# EasyEDA Pro project 电赛7_25.epro, board 1-PCB_1-PCB_主板4.3.PcbDoc copy copy
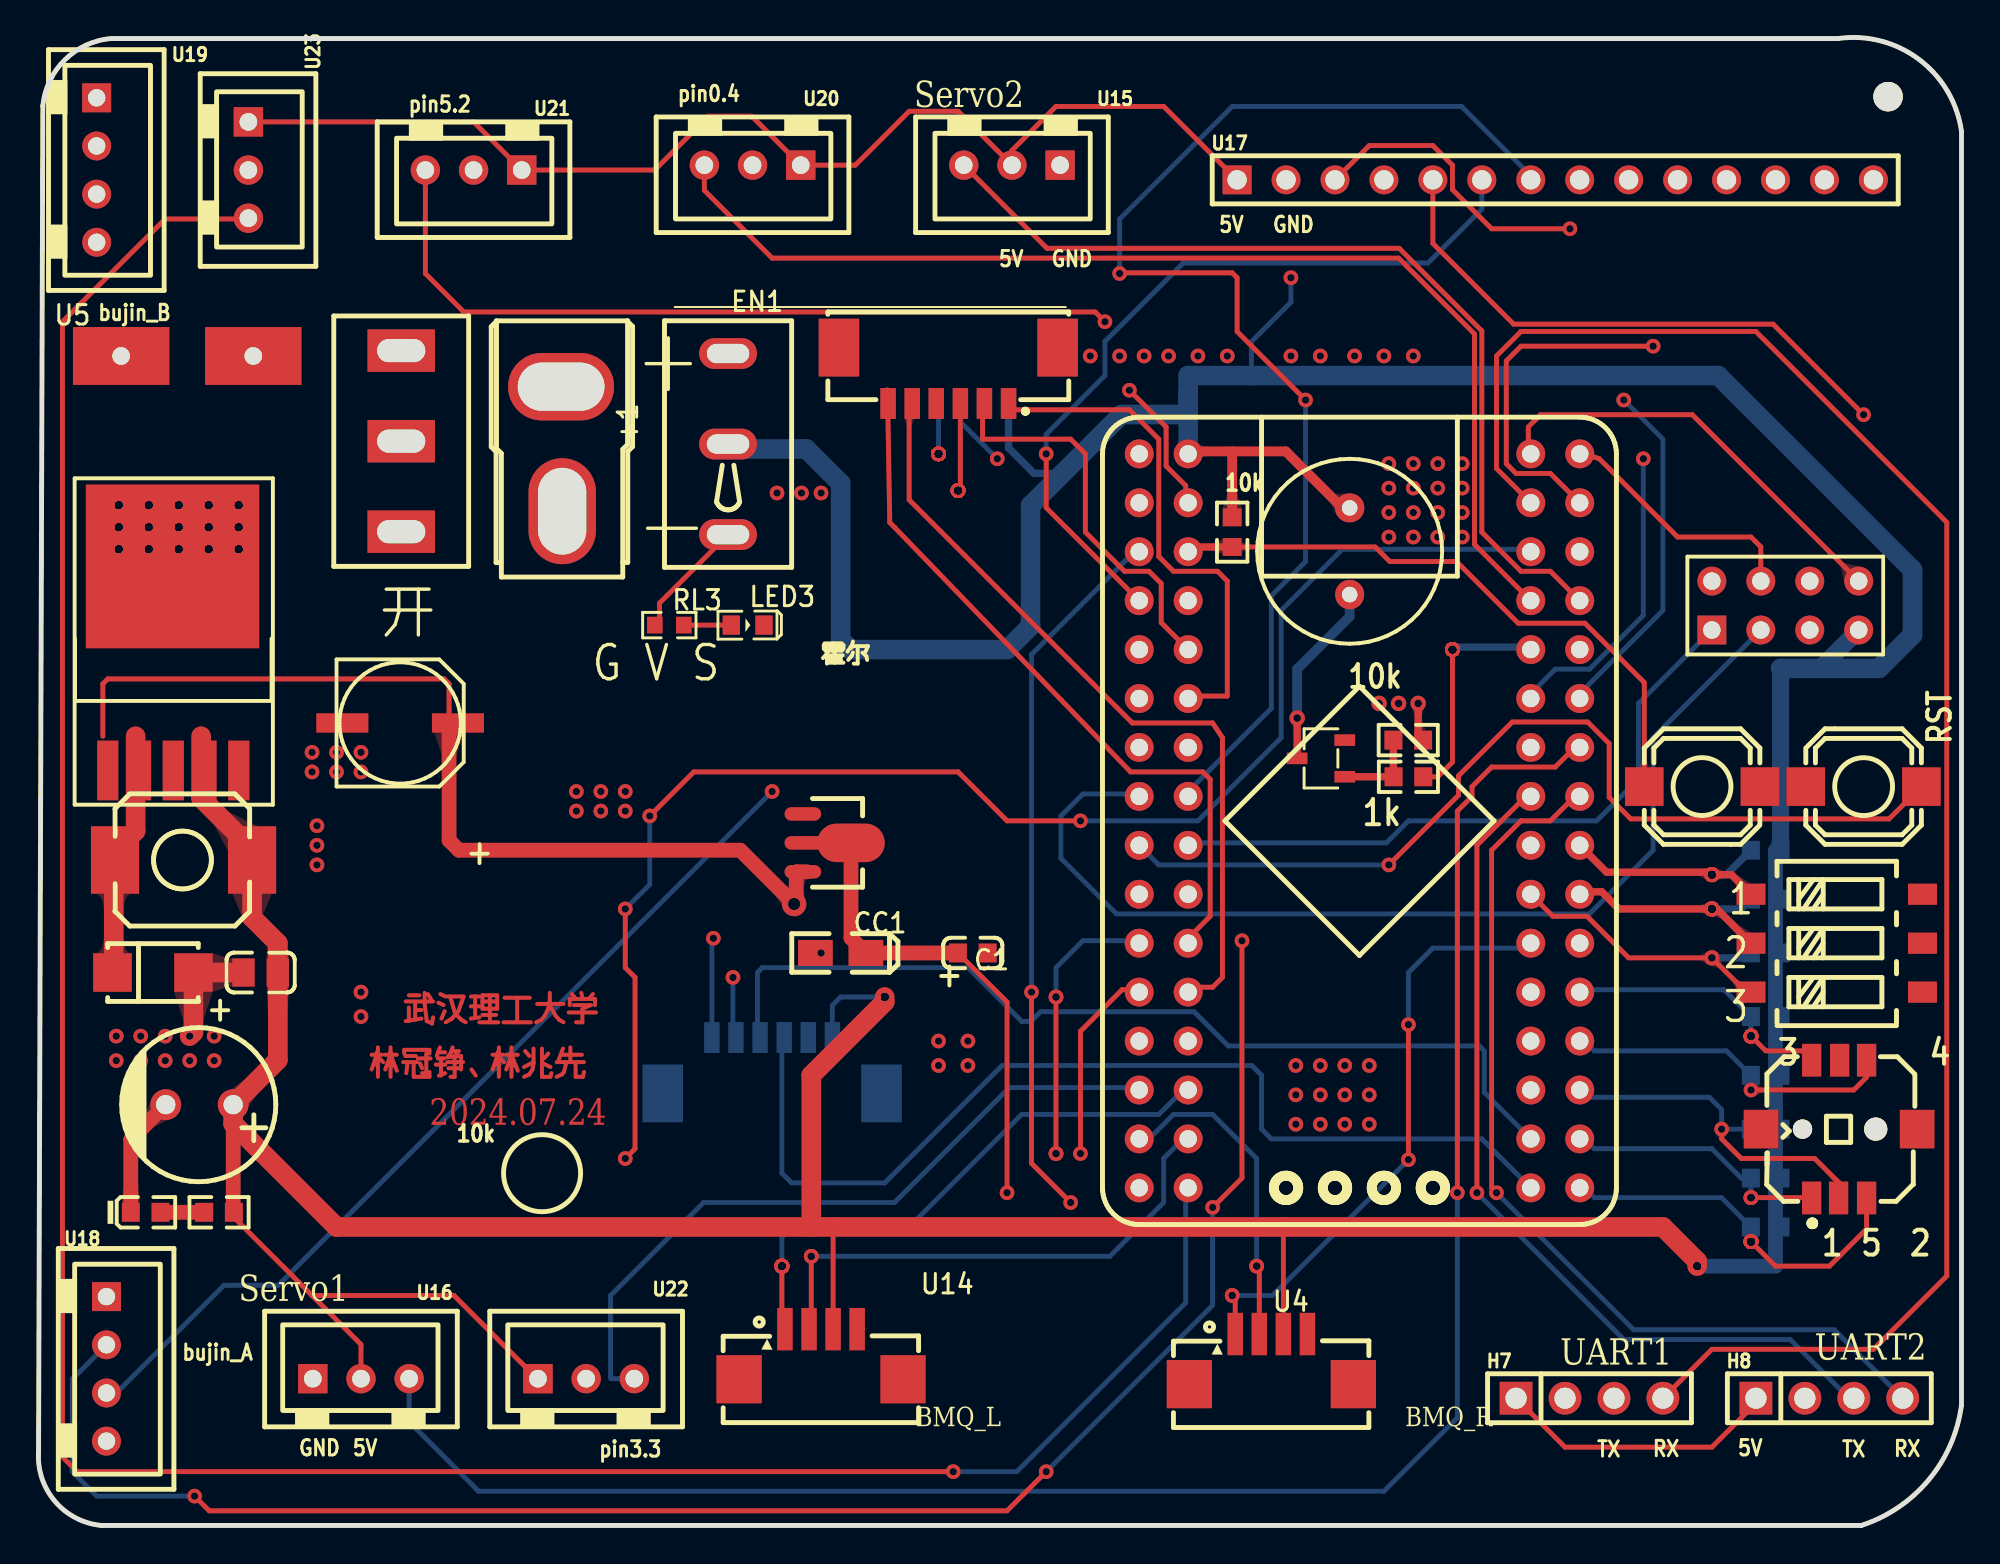
[diagram p1: board, top side]
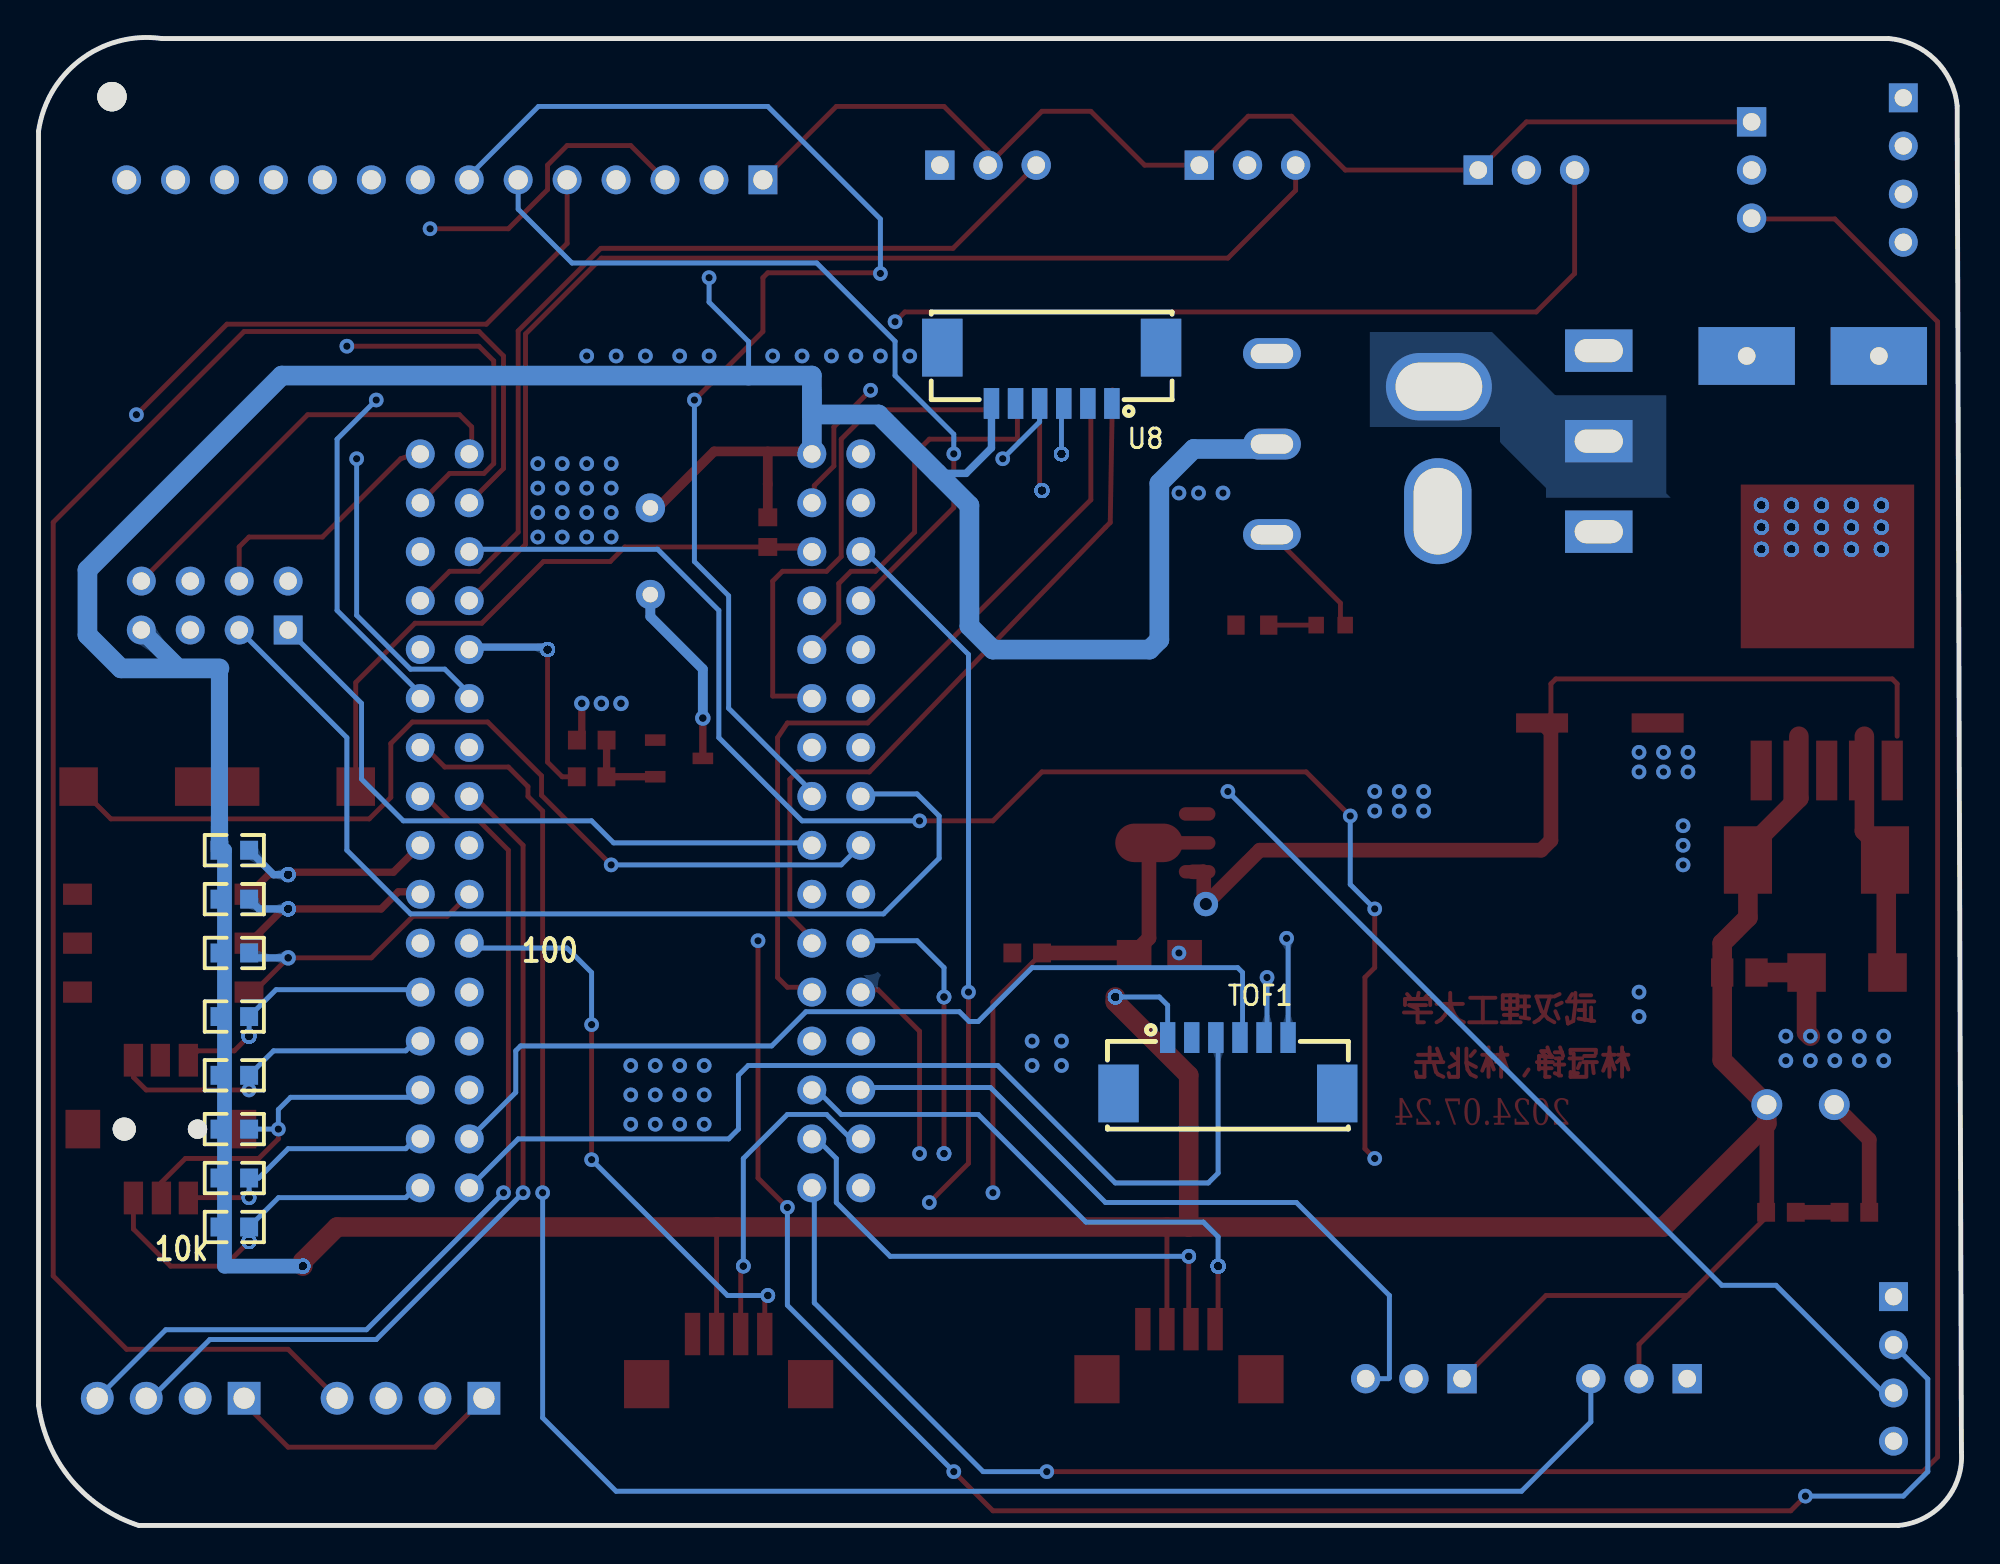
[diagram p2: board, bottom side, seen from below]

Outline 99.8 x 77.24 mm; copper layers: Top Layer, Inner1, Inner2, Bottom Layer. Coordinates in mm from the lower left corner of the outline.
Outline path: 0.01,3.81 0.23,73.69 arc(1.37,76.08) 3.79,77.18 93.4,77.18 arc(97.59,76.1) 99.8,72.37 99.8,6.24 arc(98.1,2.37) 94.6,0 3.28,0 arc(0.87,1.24) 0.01,3.81
Stack: Top Layer 0.035mm / Dielectric1 0.48mm PP er 4.5 / Inner1 0.035mm / Dielectric2 0.48mm FR4 er 4.5 / Inner2 0.035mm / Dielectric3 0.48mm PP er 4.5 / Bottom Layer 0.035mm

## Design rules (mm)
template: 用户自定义配置
spacing Default (default): track to track 0.127, other pairs 0 to 0.127
track width Default (default): min 0.254, default 0.254, max 25.4
differential pair differentialPair (default): width min 0.127, default 0.254, max 2.54; gap min 0.152, default 0.152
via Default (default): diameter min 0.762, default 0.762, max 100.025; hole min 0.381, default 0.381, max 59.995
net GND uses gge31103
net BAT uses gge75352
pour e223 uses gge75889
pour ie748 uses (1)
pour ie751 uses ba't
pour e753 uses gge75352

## Placement (name value [footprint] x y rotation side)
1  1K  [0603_R]  71.1 38.86 180 top
10  10K  [0603_R]  71.09 40.77 180 top
+1  AM-1015B-M  [CONN-TH_AM-1015B-M]  27.15 55.88 270 top
C1  104  [0603_C]  48.49 29.72 180 top
C2  220  [ED6.3]  18.77 41.66 180 top
C3  104  [0805_C]  11.53 28.7 180 top
CC1  22UF  [CASE-A_3216]  41.63 29.72 0 top
CC2  330uF  [CAP-TH_BD8.0-P3.50-D0.6-FD]  8.36 21.84 180 top
D3  SS54  [SMA(DO-214AC)_S1]  5.94 28.7 0 top
EN1  1AS1T1B1M1QES-5  [SW-TH_1AS1T1B1M1QES-5]  35.79 56.13 0 top
H7  2.54-1*4P母  [HDR-TH_4P-P2.54-V-F]  80.49 6.6 0 top
H8  2.54-1*4P母  [HDR-TH_4P-P2.54-V-F]  92.94 6.6 0 top
L2  绿灯 0603  [0603_LED_S1]  5.56 16.26 0 top
L-2  47uH  [7MMUH]  3.98 34.54 0 top
LED3  LED-0603_R  [LED0603_RED]  36.81 46.74 0 top
LS1  BUZZ  [BEEP]  68.05 52.58 270 top
NOREF  -  [Pad_e61]  95.99 74.17 0 top
Q1  S8050(丝印J3Y)  [S8050]  65.32 39.82 0 top
R4  10k  [0603_R]  9.37 16.26 180 top
R5  10K  [0603_R]  89.64 23.37 0 bottom
R6  10K  [0603_R]  89.64 26.42 0 bottom
R7  10K  [0603_R]  89.64 15.49 0 bottom
R8  10K  [0603_R]  89.64 18.03 0 bottom
R9  10K  [0603_R]  89.64 29.72 0 bottom
R10  10K  [0603_R]  89.64 32.51 0 bottom
R11  10K  [0603_R]  89.64 35.05 0 bottom
R17  10K  [0603_R]  89.64 20.57 0 bottom
R18  10K  [0603_R]  61.95 51.56 90 top
RL3  1k  [R0603]  32.74 46.74 0 top
S1  SS-12D10  [SS12D10]  18.77 56.39 90 top
SW3  TS665WS 200GF(016)  [SW-SMD_L6.0-W6.0-P6.00-LS6.6]  86.34 38.35 180 top
SW4  TS665WS 200GF(016)  [SW-SMD_L6.0-W6.0-P6.00-LS6.6]  94.72 38.35 0 top
SW5  DMR-03-T-V-T/R  [DMR-03]  88.88 32.77 270 top
SW_5WAY  TM-4175-B-A  [SW-SMD_TM-4175-B-X]  93.45 20.57 90 top
TOF1  TOF  [CONN-SMD_6P-P1.25_SHOU_1.25-6PWTDK#2]  38.08 23.88 180 bottom
U1  REG1117  [1117_SOT89]  42.17 35.43 180 top
U2  LM2596-5.0v  [LM2596S]  6.83 45.97 0 top
U3  -  [STC16]  68.56 36.58 0 top
U4  encoder2  [CONN-SMD_4P-P1.25_SHOUHAN_1.25-4PWTDK]  63.98 8.64 0 top
U5  大焊盘  [NEW_FOOTPRINT3]  7.6 60.71 90 top
U6  驱动1  [CONN-SMD_6P-P1.25_SHOU_1.25-6PWTDK]  47.22 59.69 0 top
U8  IMU660RA  [CONN-SMD_6P-P1.25_SHOU_1.25-6PWTDK#2]  47.22 59.69 0 bottom
U14  encoder1  [CONN-SMD_4P-P1.25_SHOUHAN_1.25-4PWTDK]  40.62 8.89 0 top
U15  BX-XH2.54-3PZZ  [CONN-TH_3P-P2.50_BX-XH2.54-3PZZ]  50.52 70.61 180 top
U16  BX-XH2.54-3PZZ  [CONN-TH_3P-P2.50_BX-XH2.54-3PZZ]  16.74 7.62 0 top
U17  BX-PM2.54-1-14PY  [HDR-TH_14P-P2.54-V-F-2]  78.72 69.85 0 top
U18  BX-XH2.54-4PZZ  [CONN-TH_4P-P2.50_BX-XH2.54-4PZZ]  3.53 8.13 270 top
U19  BX-XH2.54-4PZZ  [CONN-TH_4P-P2.50_BX-XH2.54-4PZZ]  3.02 70.36 270 top
U20  BX-XH2.54-3PZZ  [CONN-TH_3P-P2.50_BX-XH2.54-3PZZ]  37.06 70.61 180 top
U21  BX-XH2.54-3PZZ  [CONN-TH_3P-P2.50_BX-XH2.54-3PZZ]  22.58 70.36 180 top
U22  BX-XH2.54-3PZZ  [CONN-TH_3P-P2.50_BX-XH2.54-3PZZ]  28.42 7.62 0 top
U23  BX-XH2.54-3PZZ  [CONN-TH_3P-P2.50_BX-XH2.54-3PZZ]  10.9 70.36 270 top
无线串口  Header 4X2  [HDR2X4]  86.84 46.48 0 top

## Footprints (pads in the part's own frame, mm; a bottom-side part is the same pattern mirrored in y, then rotated)
7MMUH
  rect 2.5x3.5 smd: 1(0,0) 2(7.112,0)
0603_C
  rect 0.93x0.98 smd: 1(-0.77,0) 2(0.77,0)
0603_LED_S1
  rect 0.93x0.98 smd: A(0.77,0) K(-0.77,0)
0603_R
  rect 0.93x0.98 smd: 1(-0.77,0) 2(0.77,0)
0805_C
  rect 1.16x1.47 smd: 1(-0.89,0) 2(0.89,0)
1117_SOT89
  oval 1.9x0.7 smd: 1(2.499,-1.501) 3(2.499,1.501)
  oval 2.1x0.7 smd: 2(2.401,0)
  oval 3.5x2 smd: 4(0,0)
BEEP
  oval 1.5x1.524 hole 0.8x0.805: 1(-0.243,0)
  oval 1.524x1.5 hole 0.805x0.8: 2(4.256,0)
CAP-TH_BD8.0-P3.50-D0.6-FD
  round 1.6 hole 1: 1(-1.75,0) 2(1.75,0)
CASE-A_3216
  rect 1.8x1.35 smd: 1(1.31,0) 2(-1.31,0)
CONN-SMD_4P-P1.25_SHOUHAN_1.25-4PWTDK
  rect 0.8x2.2 smd: 1(-1.875,1.3) 2(-0.625,1.3) 3(0.625,1.3) 4(1.875,1.3)
  rect 2.35x2.5 smd: 5(4.255,-1.3) 6(-4.255,-1.3)
CONN-SMD_6P-P1.25_SHOU_1.25-6PWTDK
  rect 0.8x1.6 smd: 1(3.125,-1.45) 2(1.875,-1.45) 3(0.625,-1.45) 4(-0.625,-1.45) 5(-1.875,-1.45) 6(-3.125,-1.45)
  rect 2.1x3 smd: 7(-5.675,1.45) 8(5.675,1.45)
CONN-SMD_6P-P1.25_SHOU_1.25-6PWTDK#2
  rect 0.8x1.6 smd: 1(-3.125,1.45) 2(-1.875,1.45) 3(-0.625,1.45) 4(0.625,1.45) 5(1.875,1.45) 6(3.125,1.45)
  rect 2.1x3 smd: 7(5.675,-1.45) 8(-5.675,-1.45)
CONN-TH_3P-P2.50_BX-XH2.54-3PZZ
  rect 1.524x1.524 hole 0.914: 1(-2.5,0)
  round 1.524 hole 0.914: 2(0,0) 3(2.5,0)
CONN-TH_4P-P2.50_BX-XH2.54-4PZZ
  rect 1.5x1.5 hole 0.9: 1(-3.75,0)
  round 1.5 hole 0.9: 2(-1.25,0) 3(1.25,0) 4(3.75,0)
CONN-TH_AM-1015B-M
  oval 3.5x5.5 hole 2.5x4.5: 1(-3.231,-0.029)
  oval 5.5x3.5 hole 4.5x2.5: 2(3.231,0.029)
DMR-03
  rect 1.1x1.5 smd: 1(5.08,8.9) 2(2.54,8.9) 3(0,8.9) 4(0,0) 5(2.54,0) 6(5.08,0)
ED6.3
  rect 2.7x1 smd: 1(-3,0) 2(3,0)
HDR2X4
  rect 1.5x1.5 hole 0.905x0.9: 1(0,0)
  round 1.5 hole 0.905x0.9: 2(0,2.54) 3(2.54,0) 4(2.54,2.54) 5(5.08,0) 6(5.08,2.54) 7(7.62,0) 8(7.62,2.54)
HDR-TH_4P-P2.54-V-F
  rect 1.7x1.7 hole 1.1: 1(-3.81,0)
  round 1.7 hole 1.1: 2(-1.27,0) 3(1.27,0) 4(3.81,0)
HDR-TH_14P-P2.54-V-F-2
  rect 1.5x1.5 hole 1: 1(-16.51,0)
  round 1.5 hole 1: 2(-13.97,0) 3(-11.43,0) 4(-8.89,0) 5(-6.35,0) 6(-3.81,0) 7(-1.27,0) 8(1.27,0) 9(3.81,0) 10(6.35,0) 11(8.89,0) 12(11.43,0) 13(13.97,0) 14(16.51,0)
LED0603_RED
  rect 0.9x1 smd: 1(-0.85,0) 2(0.85,0)
LM2596S
  rect 1.1x3.1 smd: 1(-3.235,-6.785) 2(-1.535,-6.785) 3(0.165,-6.785) 4(1.865,-6.785) 5(3.565,-6.785)
  rect 9x8.5 smd: 6(0.127,3.81)
NEW_FOOTPRINT3
  rect 3x5 hole 0.914: 1(0,3.302) 2(0,-3.556)
Pad_e61
  round 1.524 hole 3: 65(0,0)
R0603
  rect 0.806x0.864 smd: 1(-0.753,0) 2(0.753,0)
S8050
  rect 1.07x0.6 smd: 1(2.47,-0.95) 2(2.47,0.95) 3(0,0)
SMA(DO-214AC)_S1
  rect 2x2 smd: 1(2.1,0) 2(-2.1,0)
SS12D10
  rect 2.2x3.5 hole 1.2x2.5: 1(-4.803,-0.056) 2(-0.104,-0.056) 3(4.595,-0.056)
STC16
  round 1.5 hole 0.905x0.9: 1(-11.43,19.05) 2(-8.89,19.05) 3(-11.43,16.51) 4(-8.89,16.51) 5(-11.43,13.97) 6(-8.89,13.97) 7(-11.43,11.43) 9(-11.43,8.89) 10(-8.89,8.89) 11(-11.43,6.35) 12(-8.89,6.35) 13(-11.43,3.81) 14(-8.89,3.81) 15(-11.43,1.27) 16(-8.89,1.27) 17(-11.43,-1.27) 18(-8.89,-1.27) 19(-11.43,-3.81) 20(-8.89,-3.81) 21(-11.43,-6.35) 22(-8.89,-6.35) 23(-11.43,-8.89) 24(-8.89,-8.89) 27(-11.43,-13.97) 28(-8.89,-13.97) 29(-11.43,-16.51) 30(-8.89,-16.51) 33(8.89,-19.05) 34(11.43,-19.05) 35(8.89,-16.51) 36(11.43,-16.51) 37(8.89,-13.97) 38(11.43,-13.97) 40(11.43,-11.43) 41(8.89,-8.89) 42(11.43,-8.89) 43(8.89,-6.35) 44(11.43,-6.35) 45(8.89,-3.81) 46(11.43,-3.81) 48(11.43,-1.27) 49(8.89,1.27) 50(11.43,1.27) 51(8.89,3.81) 52(11.43,3.81) 53(8.89,6.35) 55(8.89,8.89) 56(11.43,8.89) 58(11.43,11.43) 59(8.89,13.97) 60(11.43,13.97) 61(8.89,16.51) 63(8.89,19.05) 64(11.43,19.05)
  round 1.5 hole 0.9: 8(-8.89,11.43) 25(-11.43,-11.43) 26(-8.89,-11.43) 31(-11.43,-19.05) 32(-8.89,-19.05) 39(8.89,-11.43) 47(8.89,-1.27) 54(11.43,6.35) 57(8.89,11.43) 62(11.43,16.51)
SW-SMD_L6.0-W6.0-P6.00-LS6.6
  rect 2x2 smd: 1(-3,0) 2(3,0)
SW-SMD_TM-4175-B-X
  rect 1.7x1 smd: 1(-3.575,1.425) 2(-3.575,0.028) 3(-3.575,-1.425) 4(3.575,1.425) 5(3.575,-0.028) 6(3.575,-1.425)
  rect 2x1.8 smd: 7(0,-4.05) 8(0,4.05)
  round 1 hole 1.005x1: 9(0,1.9)
  round 1.2 hole 1.205x1.2: 10(0,-1.9)
SW-TH_1AS1T1B1M1QES-5
  oval 3x1.6 hole 2.2x1: 1(0,-4.7) 2(0,0) 3(0,4.7)

## Nets
As in the schematic, except:
3V3: C1.2 CC1.1 U1.2 U1.4 U17.8

Pads without a net: EN1 3; NOREF 65; S1 3; SW_5WAY 8 9 10; TOF1 7 8; U2 6; U3 8 11 14 20 25 26 31 39 44 60; U6 7 8; U8 1 2 7 8; U17 9 10 11 12 13 14; 无线串口 2

## Via types
v1: diameter 0.762, hole 0.381, Top Layer to Bottom Layer, 1724 vias
v2: diameter 0.8, hole 0.4, Top Layer to Bottom Layer, 22 vias
v3: diameter 1.27, hole 0.635, Top Layer to Bottom Layer, 1 via

## Routing (per net, layer and track width the routed paths; a pad name or vN(x,y) marks a point on that pad's centre or on a via; arc(x,y) is an arc through that point)
3V3: length 159.6
  Top Layer w0.254: C1.2 50.27,27.17 v1(50.27,17.27)
  Top Layer w0.762: U1.4 42.17,30.49 CC1.1 C1.2
  Inner1 w0.254: v1(50.27,17.27) 50.27,9.4 56.37,3.3 96.09,3.3 99.17,6.38 99.17,56.28 90.42,65.02 84.81,65.02 U17.8
+5V: length 14.4
  Top Layer w0.254: H7.1 79.23,4.06 86.85,4.06 89.13,6.35
GND: length 14.3
  Top Layer w0.381: 71.92,40.83 71.6,41.15 v2(71.6,42.67)
  Top Layer w0.762: CC2.2 4.79,20.03 L2.K
  Top Layer w1.016: v1(7.85,25.4) 8.04,25.59 8.04,28.7 C3.2
  vias: v1(4.04,25.4) v1(4.04,24.13) v1(5.31,25.4) v1(5.31,24.13) v1(6.58,25.4) v1(6.58,24.13) v1(7.85,24.13) v1(9.12,25.4) v1(9.12,24.13) v1(14.2,40.13) v1(14.2,39.12) v1(14.45,36.32) v1(14.45,35.31) v1(14.45,34.29) v1(15.47,40.13) v1(15.47,39.12) v1(16.74,40.13) v1(16.74,39.12) v1(16.74,27.69) v1(16.74,26.42) v1(27.92,38.1) v1(27.92,37.08) v1(29.19,38.1) v1(29.19,37.08) v1(30.46,38.1) v1(30.46,37.08) v1(38.33,53.59) v1(39.6,53.59) v1(40.62,53.59) v1(40.62,29.72) v1(46.71,25.15) v1(46.71,23.88) v1(48.24,25.15) v1(48.24,23.88) v1(54.59,60.71) v1(56.11,60.71) v1(57.38,60.71) v1(58.65,60.71) v1(60.17,60.71) v1(61.7,60.71) v1(65,60.71) v1(65.25,23.88) v1(65.25,22.35) v1(65.25,20.83) v1(66.52,60.71) v1(66.52,23.88) v1(66.52,22.35) v1(66.52,20.83) v1(67.79,23.88) v1(67.79,22.35) v1(67.79,20.83) v1(68.3,60.71) v1(69.06,23.88) v1(69.06,22.35) v1(69.06,20.83) v1(69.83,60.71) v1(70.08,55.12) v1(70.08,53.85) v1(70.08,52.58) v1(70.08,51.31) v1(71.35,60.71) v1(71.35,55.12) v1(71.35,53.85) v1(71.35,52.58) v1(71.35,51.31) v1(72.62,55.12) v1(72.62,53.85) v1(72.62,52.58) v1(72.62,51.31) v1(73.89,55.12) v1(73.89,53.85) v1(73.89,52.58) v1(73.89,51.31) v2(69.57,42.67) v2(70.59,42.67)
(no net): length 0.3
  Top Layer w0.254: 79.86,30.35 80.05,30.54
  vias: v1(4.17,52.96) v1(4.17,52.96) v1(4.17,52.96) v1(4.17,52.96) v1(4.17,52.96) v1(4.17,52.96) v1(4.17,52.96) v1(4.17,52.96) v1(4.17,52.96) v1(4.17,52.96) v1(4.17,52.96) v1(4.17,52.96) v1(4.17,52.96) v1(4.17,52.96) v1(4.17,52.96) v1(4.17,52.96) v1(4.17,52.96) v1(4.17,52.96) v1(4.17,52.96) v1(4.17,52.96) v1(4.17,52.96) v1(4.17,52.96) v1(4.17,52.96) v1(4.17,52.96) v1(4.17,52.96) v1(4.17,52.96) v1(4.17,52.96) v1(4.17,52.96) v1(4.17,52.96) v1(4.17,52.96) v1(4.17,52.96) v1(4.17,52.96) v1(4.17,52.96) v1(4.17,52.96) v1(4.17,52.96) v1(4.17,52.96) v1(4.17,52.96) v1(4.17,52.96) v1(4.17,52.96) v1(4.17,52.96) v1(4.17,52.96) v1(4.17,52.96) v1(4.17,52.96) v1(4.17,52.96) v1(4.17,52.96) v1(4.17,52.96) v1(4.17,52.96) v1(4.17,52.96) v1(4.17,52.96) v1(4.17,52.96) v1(4.17,52.96) v1(4.17,52.96) v1(4.17,52.96) v1(4.17,52.96) v1(4.17,52.96) v1(4.17,52.96) v1(4.17,52.96) v1(4.17,52.96) v1(4.17,52.96) v1(4.17,52.96) v1(4.17,52.96) v1(4.17,52.96) v1(4.17,52.96) v1(4.17,51.82) v1(4.17,51.82) v1(4.17,51.82) v1(4.17,51.82) v1(4.17,51.82) v1(4.17,51.82) v1(4.17,51.82) v1(4.17,51.82) v1(4.17,51.82) v1(4.17,51.82) v1(4.17,51.82) v1(4.17,51.82) v1(4.17,51.82) v1(4.17,51.82) v1(4.17,51.82) v1(4.17,51.82) v1(4.17,51.82) v1(4.17,51.82) v1(4.17,51.82) v1(4.17,51.82) v1(4.17,51.82) v1(4.17,51.82) v1(4.17,51.82) v1(4.17,51.82) v1(4.17,51.82) v1(4.17,51.82) v1(4.17,51.82) v1(4.17,51.82) v1(4.17,51.82) v1(4.17,51.82) v1(4.17,51.82) v1(4.17,51.82) v1(4.17,51.82) v1(4.17,51.82) v1(4.17,51.82) v1(4.17,51.82) v1(4.17,51.82) v1(4.17,51.82) v1(4.17,51.82) v1(4.17,51.82) v1(4.17,51.82) v1(4.17,51.82) v1(4.17,51.82) v1(4.17,51.82) v1(4.17,51.82) v1(4.17,51.82) v1(4.17,51.82) v1(4.17,51.82) v1(4.17,51.82) v1(4.17,51.82) v1(4.17,51.82) v1(4.17,51.82) v1(4.17,51.82) v1(4.17,51.82) v1(4.17,51.82) v1(4.17,51.82) v1(4.17,51.82) v1(4.17,51.82) v1(4.17,51.82) v1(4.17,51.82) v1(4.17,51.82) v1(4.17,51.82) v1(4.17,51.82) v1(4.17,50.67) v1(4.17,50.67) v1(4.17,50.67) v1(4.17,50.67) v1(4.17,50.67) v1(4.17,50.67) v1(4.17,50.67) v1(4.17,50.67) v1(4.17,50.67) v1(4.17,50.67) v1(4.17,50.67) v1(4.17,50.67) v1(4.17,50.67) v1(4.17,50.67) v1(4.17,50.67) v1(4.17,50.67) v1(4.17,50.67) v1(4.17,50.67) v1(4.17,50.67) v1(4.17,50.67) v1(4.17,50.67) v1(4.17,50.67) v1(4.17,50.67) v1(4.17,50.67) v1(4.17,50.67) v1(4.17,50.67) v1(4.17,50.67) v1(4.17,50.67) v1(4.17,50.67) v1(4.17,50.67) v1(4.17,50.67) v1(4.17,50.67) v1(4.17,50.67) v1(4.17,50.67) v1(4.17,50.67) v1(4.17,50.67) v1(4.17,50.67) v1(4.17,50.67) v1(4.17,50.67) v1(4.17,50.67) v1(4.17,50.67) v1(4.17,50.67) v1(4.17,50.67) v1(4.17,50.67) v1(4.17,50.67) v1(4.17,50.67) v1(4.17,50.67) v1(4.17,50.67) v1(4.17,50.67) v1(4.17,50.67) v1(4.17,50.67) v1(4.17,50.67) v1(4.17,50.67) v1(4.17,50.67) v1(4.17,50.67) v1(4.17,50.67) v1(4.17,50.67) v1(4.17,50.67) v1(4.17,50.67) v1(4.17,50.67) v1(4.17,50.67) v1(4.17,50.67) v1(4.17,50.67) v1(5.72,52.96) v1(5.72,52.96) v1(5.72,52.96) v1(5.72,52.96) v1(5.72,52.96) v1(5.72,52.96) v1(5.72,52.96) v1(5.72,52.96) v1(5.72,52.96) v1(5.72,52.96) v1(5.72,52.96) v1(5.72,52.96) v1(5.72,52.96) v1(5.72,52.96) v1(5.72,52.96) v1(5.72,52.96) v1(5.72,52.96) v1(5.72,52.96) v1(5.72,52.96) v1(5.72,52.96) v1(5.72,52.96) v1(5.72,52.96) v1(5.72,52.96) v1(5.72,52.96) v1(5.72,52.96) v1(5.72,52.96) v1(5.72,52.96) v1(5.72,52.96) v1(5.72,52.96) v1(5.72,52.96) v1(5.72,52.96) v1(5.72,52.96) v1(5.72,52.96) v1(5.72,52.96) v1(5.72,52.96) v1(5.72,52.96) v1(5.72,52.96) v1(5.72,52.96) v1(5.72,52.96) v1(5.72,52.96) v1(5.72,52.96) v1(5.72,52.96) v1(5.72,52.96) v1(5.72,52.96) v1(5.72,52.96) v1(5.72,52.96) v1(5.72,52.96) v1(5.72,52.96) v1(5.72,52.96) v1(5.72,52.96) v1(5.72,52.96) v1(5.72,52.96) v1(5.72,52.96) v1(5.72,52.96) v1(5.72,52.96) v1(5.72,52.96) v1(5.72,52.96) v1(5.72,52.96) v1(5.72,52.96) v1(5.72,52.96) v1(5.72,52.96) v1(5.72,52.96) v1(5.72,52.96) v1(5.72,51.82) v1(5.72,51.82) v1(5.72,51.82) v1(5.72,51.82) v1(5.72,51.82) v1(5.72,51.82) v1(5.72,51.82) v1(5.72,51.82) v1(5.72,51.82) v1(5.72,51.82) v1(5.72,51.82) v1(5.72,51.82) v1(5.72,51.82) v1(5.72,51.82) v1(5.72,51.82) v1(5.72,51.82) v1(5.72,51.82) v1(5.72,51.82) v1(5.72,51.82) v1(5.72,51.82) v1(5.72,51.82) v1(5.72,51.82) v1(5.72,51.82) v1(5.72,51.82) v1(5.72,51.82) v1(5.72,51.82) v1(5.72,51.82) v1(5.72,51.82) v1(5.72,51.82) v1(5.72,51.82) v1(5.72,51.82) v1(5.72,51.82) v1(5.72,51.82) v1(5.72,51.82) v1(5.72,51.82) v1(5.72,51.82) v1(5.72,51.82) v1(5.72,51.82) v1(5.72,51.82) v1(5.72,51.82) v1(5.72,51.82) v1(5.72,51.82) v1(5.72,51.82) v1(5.72,51.82) v1(5.72,51.82) v1(5.72,51.82) v1(5.72,51.82) v1(5.72,51.82) v1(5.72,51.82) v1(5.72,51.82) v1(5.72,51.82) v1(5.72,51.82) v1(5.72,51.82) v1(5.72,51.82) v1(5.72,51.82) v1(5.72,51.82) v1(5.72,51.82) v1(5.72,51.82) v1(5.72,51.82) v1(5.72,51.82) v1(5.72,51.82) v1(5.72,51.82) v1(5.72,51.82) v1(5.72,50.67) v1(5.72,50.67) v1(5.72,50.67) v1(5.72,50.67) v1(5.72,50.67) v1(5.72,50.67) v1(5.72,50.67) v1(5.72,50.67) v1(5.72,50.67) v1(5.72,50.67) v1(5.72,50.67) v1(5.72,50.67) v1(5.72,50.67) v1(5.72,50.67) v1(5.72,50.67) v1(5.72,50.67) v1(5.72,50.67) v1(5.72,50.67) v1(5.72,50.67) v1(5.72,50.67) v1(5.72,50.67) v1(5.72,50.67) v1(5.72,50.67) v1(5.72,50.67) v1(5.72,50.67) v1(5.72,50.67) v1(5.72,50.67) v1(5.72,50.67) v1(5.72,50.67) v1(5.72,50.67) v1(5.72,50.67) v1(5.72,50.67) v1(5.72,50.67) v1(5.72,50.67) v1(5.72,50.67) v1(5.72,50.67) v1(5.72,50.67) v1(5.72,50.67) v1(5.72,50.67) v1(5.72,50.67) v1(5.72,50.67) v1(5.72,50.67) v1(5.72,50.67) v1(5.72,50.67) v1(5.72,50.67) v1(5.72,50.67) v1(5.72,50.67) v1(5.72,50.67) v1(5.72,50.67) v1(5.72,50.67) v1(5.72,50.67) v1(5.72,50.67) v1(5.72,50.67) v1(5.72,50.67) v1(5.72,50.67) v1(5.72,50.67) v1(5.72,50.67) v1(5.72,50.67) v1(5.72,50.67) v1(5.72,50.67) v1(5.72,50.67) v1(5.72,50.67) v1(5.72,50.67) v1(7.28,52.96) v1(7.28,52.96) v1(7.28,52.96) v1(7.28,52.96) v1(7.28,52.96) v1(7.28,52.96) v1(7.28,52.96) v1(7.28,52.96) v1(7.28,52.96) v1(7.28,52.96) v1(7.28,52.96) v1(7.28,52.96) v1(7.28,52.96) v1(7.28,52.96) v1(7.28,52.96) v1(7.28,52.96) v1(7.28,52.96) v1(7.28,52.96) v1(7.28,52.96) v1(7.28,52.96) v1(7.28,52.96) v1(7.28,52.96) v1(7.28,52.96) v1(7.28,52.96) v1(7.28,52.96) v1(7.28,52.96) v1(7.28,52.96) v1(7.28,52.96) v1(7.28,52.96) v1(7.28,52.96) v1(7.28,52.96) v1(7.28,52.96) v1(7.28,52.96) v1(7.28,52.96) v1(7.28,52.96) v1(7.28,52.96) v1(7.28,52.96) v1(7.28,52.96) v1(7.28,52.96) v1(7.28,52.96) v1(7.28,52.96) v1(7.28,52.96) v1(7.28,52.96) v1(7.28,52.96) v1(7.28,52.96) v1(7.28,52.96) v1(7.28,52.96) v1(7.28,52.96) v1(7.28,52.96) v1(7.28,52.96) v1(7.28,52.96) v1(7.28,52.96) v1(7.28,52.96) v1(7.28,52.96) v1(7.28,52.96) v1(7.28,52.96) v1(7.28,52.96) v1(7.28,52.96) v1(7.28,52.96) v1(7.28,52.96) v1(7.28,52.96) v1(7.28,52.96) v1(7.28,52.96) v1(7.28,51.82) v1(7.28,51.82) v1(7.28,51.82) v1(7.28,51.82) v1(7.28,51.82) v1(7.28,51.82) v1(7.28,51.82) v1(7.28,51.82) v1(7.28,51.82) v1(7.28,51.82) v1(7.28,51.82) v1(7.28,51.82) v1(7.28,51.82) v1(7.28,51.82) v1(7.28,51.82) v1(7.28,51.82) v1(7.28,51.82) v1(7.28,51.82) v1(7.28,51.82) v1(7.28,51.82) v1(7.28,51.82) v1(7.28,51.82) v1(7.28,51.82) v1(7.28,51.82) v1(7.28,51.82) v1(7.28,51.82) v1(7.28,51.82) v1(7.28,51.82) v1(7.28,51.82) v1(7.28,51.82) v1(7.28,51.82) v1(7.28,51.82) v1(7.28,51.82) v1(7.28,51.82) v1(7.28,51.82) v1(7.28,51.82) v1(7.28,51.82) v1(7.28,51.82) v1(7.28,51.82) v1(7.28,51.82) v1(7.28,51.82) v1(7.28,51.82) v1(7.28,51.82) v1(7.28,51.82) v1(7.28,51.82) v1(7.28,51.82) v1(7.28,51.82) v1(7.28,51.82) v1(7.28,51.82) v1(7.28,51.82) v1(7.28,51.82) v1(7.28,51.82) v1(7.28,51.82) v1(7.28,51.82) v1(7.28,51.82) v1(7.28,51.82) v1(7.28,51.82) v1(7.28,51.82) v1(7.28,51.82) v1(7.28,51.82) v1(7.28,51.82) v1(7.28,51.82) v1(7.28,51.82) v1(7.28,50.67) v1(7.28,50.67) v1(7.28,50.67) v1(7.28,50.67) v1(7.28,50.67) v1(7.28,50.67) v1(7.28,50.67) v1(7.28,50.67) v1(7.28,50.67) v1(7.28,50.67) v1(7.28,50.67) v1(7.28,50.67) v1(7.28,50.67) v1(7.28,50.67) v1(7.28,50.67) v1(7.28,50.67) v1(7.28,50.67) v1(7.28,50.67) v1(7.28,50.67) v1(7.28,50.67) v1(7.28,50.67) v1(7.28,50.67) v1(7.28,50.67) v1(7.28,50.67) v1(7.28,50.67) v1(7.28,50.67) v1(7.28,50.67) v1(7.28,50.67) v1(7.28,50.67) v1(7.28,50.67) v1(7.28,50.67) v1(7.28,50.67) v1(7.28,50.67) v1(7.28,50.67) v1(7.28,50.67) v1(7.28,50.67) v1(7.28,50.67) v1(7.28,50.67) v1(7.28,50.67) v1(7.28,50.67) v1(7.28,50.67) v1(7.28,50.67) v1(7.28,50.67) v1(7.28,50.67) v1(7.28,50.67) v1(7.28,50.67) v1(7.28,50.67) v1(7.28,50.67) v1(7.28,50.67) v1(7.28,50.67) v1(7.28,50.67) v1(7.28,50.67) v1(7.28,50.67) v1(7.28,50.67) v1(7.28,50.67) v1(7.28,50.67) v1(7.28,50.67) v1(7.28,50.67) v1(7.28,50.67) v1(7.28,50.67) v1(7.28,50.67) v1(7.28,50.67) v1(7.28,50.67) v1(8.83,52.96) v1(8.83,52.96) v1(8.83,52.96) v1(8.83,52.96) v1(8.83,52.96) v1(8.83,52.96) v1(8.83,52.96) v1(8.83,52.96) v1(8.83,52.96) v1(8.83,52.96) v1(8.83,52.96) v1(8.83,52.96) v1(8.83,52.96) v1(8.83,52.96) v1(8.83,52.96) v1(8.83,52.96) v1(8.83,52.96) v1(8.83,52.96) v1(8.83,52.96) v1(8.83,52.96) v1(8.83,52.96) v1(8.83,52.96) v1(8.83,52.96) v1(8.83,52.96) v1(8.83,52.96) v1(8.83,52.96) v1(8.83,52.96) v1(8.83,52.96) v1(8.83,52.96) v1(8.83,52.96) v1(8.83,52.96) v1(8.83,52.96) v1(8.83,52.96) v1(8.83,52.96) v1(8.83,52.96) v1(8.83,52.96) v1(8.83,52.96) v1(8.83,52.96) v1(8.83,52.96) v1(8.83,52.96) v1(8.83,52.96) v1(8.83,52.96) v1(8.83,52.96) v1(8.83,52.96) v1(8.83,52.96) v1(8.83,52.96) v1(8.83,52.96) v1(8.83,52.96) v1(8.83,52.96) v1(8.83,52.96) v1(8.83,52.96) v1(8.83,52.96) v1(8.83,52.96) v1(8.83,52.96) v1(8.83,52.96) v1(8.83,52.96) v1(8.83,52.96) v1(8.83,52.96) v1(8.83,52.96) v1(8.83,52.96) v1(8.83,52.96) v1(8.83,52.96) v1(8.83,52.96) v1(8.83,51.82) v1(8.83,51.82) v1(8.83,51.82) v1(8.83,51.82) v1(8.83,51.82) v1(8.83,51.82) v1(8.83,51.82) v1(8.83,51.82) v1(8.83,51.82) v1(8.83,51.82) v1(8.83,51.82) v1(8.83,51.82) v1(8.83,51.82) v1(8.83,51.82) v1(8.83,51.82) v1(8.83,51.82) v1(8.83,51.82) v1(8.83,51.82) v1(8.83,51.82) v1(8.83,51.82) v1(8.83,51.82) v1(8.83,51.82) v1(8.83,51.82) v1(8.83,51.82) v1(8.83,51.82) v1(8.83,51.82) v1(8.83,51.82) v1(8.83,51.82) v1(8.83,51.82) v1(8.83,51.82) v1(8.83,51.82) v1(8.83,51.82) v1(8.83,51.82) v1(8.83,51.82) v1(8.83,51.82) v1(8.83,51.82) v1(8.83,51.82) v1(8.83,51.82) v1(8.83,51.82) v1(8.83,51.82) v1(8.83,51.82) v1(8.83,51.82) v1(8.83,51.82) v1(8.83,51.82) v1(8.83,51.82) v1(8.83,51.82) v1(8.83,51.82) v1(8.83,51.82) v1(8.83,51.82) v1(8.83,51.82) v1(8.83,51.82) v1(8.83,51.82) v1(8.83,51.82) v1(8.83,51.82) v1(8.83,51.82) v1(8.83,51.82) v1(8.83,51.82) v1(8.83,51.82) v1(8.83,51.82) v1(8.83,51.82) v1(8.83,51.82) v1(8.83,51.82) v1(8.83,51.82) v1(8.83,50.67) v1(8.83,50.67) v1(8.83,50.67) v1(8.83,50.67) v1(8.83,50.67) v1(8.83,50.67) v1(8.83,50.67) v1(8.83,50.67) v1(8.83,50.67) v1(8.83,50.67) v1(8.83,50.67) v1(8.83,50.67) v1(8.83,50.67) v1(8.83,50.67) v1(8.83,50.67) v1(8.83,50.67) v1(8.83,50.67) v1(8.83,50.67) v1(8.83,50.67) v1(8.83,50.67) v1(8.83,50.67) v1(8.83,50.67) v1(8.83,50.67) v1(8.83,50.67) v1(8.83,50.67) v1(8.83,50.67) v1(8.83,50.67) v1(8.83,50.67) v1(8.83,50.67) v1(8.83,50.67) v1(8.83,50.67) v1(8.83,50.67) v1(8.83,50.67) v1(8.83,50.67) v1(8.83,50.67) v1(8.83,50.67) v1(8.83,50.67) v1(8.83,50.67) v1(8.83,50.67) v1(8.83,50.67) v1(8.83,50.67) v1(8.83,50.67) v1(8.83,50.67) v1(8.83,50.67) v1(8.83,50.67) v1(8.83,50.67) v1(8.83,50.67) v1(8.83,50.67) v1(8.83,50.67) v1(8.83,50.67) v1(8.83,50.67) v1(8.83,50.67) v1(8.83,50.67) v1(8.83,50.67) v1(8.83,50.67) v1(8.83,50.67) v1(8.83,50.67) v1(8.83,50.67) v1(8.83,50.67) v1(8.83,50.67) v1(8.83,50.67) v1(8.83,50.67) v1(8.83,50.67) v1(10.39,52.96) v1(10.39,52.96) v1(10.39,52.96) v1(10.39,52.96) v1(10.39,52.96) v1(10.39,52.96) v1(10.39,52.96) v1(10.39,52.96) v1(10.39,52.96) v1(10.39,52.96) v1(10.39,52.96) v1(10.39,52.96) v1(10.39,52.96) v1(10.39,52.96) v1(10.39,52.96) v1(10.39,52.96) v1(10.39,52.96) v1(10.39,52.96) v1(10.39,52.96) v1(10.39,52.96) v1(10.39,52.96) v1(10.39,52.96) v1(10.39,52.96) v1(10.39,52.96) v1(10.39,52.96) v1(10.39,52.96) v1(10.39,52.96) v1(10.39,52.96) v1(10.39,52.96) v1(10.39,52.96) v1(10.39,52.96) v1(10.39,52.96) v1(10.39,52.96) v1(10.39,52.96) v1(10.39,52.96) v1(10.39,52.96) v1(10.39,52.96) v1(10.39,52.96) v1(10.39,52.96) v1(10.39,52.96) v1(10.39,52.96) v1(10.39,52.96) v1(10.39,52.96) v1(10.39,52.96) v1(10.39,52.96) v1(10.39,52.96) v1(10.39,52.96) v1(10.39,52.96) v1(10.39,52.96) v1(10.39,52.96) v1(10.39,52.96) v1(10.39,52.96) v1(10.39,52.96) v1(10.39,52.96) v1(10.39,52.96) v1(10.39,52.96) v1(10.39,52.96) v1(10.39,52.96) v1(10.39,52.96) v1(10.39,52.96) v1(10.39,52.96) v1(10.39,52.96) v1(10.39,52.96) v1(10.39,51.82) v1(10.39,51.82) v1(10.39,51.82) v1(10.39,51.82) v1(10.39,51.82) v1(10.39,51.82) v1(10.39,51.82) v1(10.39,51.82) v1(10.39,51.82) v1(10.39,51.82) v1(10.39,51.82) v1(10.39,51.82) v1(10.39,51.82) v1(10.39,51.82) v1(10.39,51.82) v1(10.39,51.82) v1(10.39,51.82) v1(10.39,51.82) v1(10.39,51.82) v1(10.39,51.82) v1(10.39,51.82) v1(10.39,51.82) v1(10.39,51.82) v1(10.39,51.82) v1(10.39,51.82) v1(10.39,51.82) v1(10.39,51.82) v1(10.39,51.82) v1(10.39,51.82) v1(10.39,51.82) v1(10.39,51.82) v1(10.39,51.82) v1(10.39,51.82) v1(10.39,51.82) v1(10.39,51.82) v1(10.39,51.82) v1(10.39,51.82) v1(10.39,51.82) v1(10.39,51.82) v1(10.39,51.82) v1(10.39,51.82) v1(10.39,51.82) v1(10.39,51.82) v1(10.39,51.82) v1(10.39,51.82) v1(10.39,51.82) v1(10.39,51.82) v1(10.39,51.82) v1(10.39,51.82) v1(10.39,51.82) v1(10.39,51.82) v1(10.39,51.82) v1(10.39,51.82) v1(10.39,51.82) v1(10.39,51.82) v1(10.39,51.82) v1(10.39,51.82) v1(10.39,51.82) v1(10.39,51.82) v1(10.39,51.82) v1(10.39,51.82) v1(10.39,51.82) v1(10.39,51.82) v1(10.39,50.67) v1(10.39,50.67) v1(10.39,50.67) v1(10.39,50.67) v1(10.39,50.67) v1(10.39,50.67) v1(10.39,50.67) v1(10.39,50.67) v1(10.39,50.67) v1(10.39,50.67) v1(10.39,50.67) v1(10.39,50.67) v1(10.39,50.67) v1(10.39,50.67) v1(10.39,50.67) v1(10.39,50.67) v1(10.39,50.67) v1(10.39,50.67) v1(10.39,50.67) v1(10.39,50.67) v1(10.39,50.67) v1(10.39,50.67) v1(10.39,50.67) v1(10.39,50.67) v1(10.39,50.67) v1(10.39,50.67) v1(10.39,50.67) v1(10.39,50.67) v1(10.39,50.67) v1(10.39,50.67) v1(10.39,50.67) v1(10.39,50.67) v1(10.39,50.67) v1(10.39,50.67) v1(10.39,50.67) v1(10.39,50.67) v1(10.39,50.67) v1(10.39,50.67) v1(10.39,50.67) v1(10.39,50.67) v1(10.39,50.67) v1(10.39,50.67) v1(10.39,50.67) v1(10.39,50.67) v1(10.39,50.67) v1(10.39,50.67) v1(10.39,50.67) v1(10.39,50.67) v1(10.39,50.67) v1(10.39,50.67) v1(10.39,50.67) v1(10.39,50.67) v1(10.39,50.67) v1(10.39,50.67) v1(10.39,50.67) v1(10.39,50.67) v1(10.39,50.67) v1(10.39,50.67) v1(10.39,50.67) v1(10.39,50.67) v1(10.39,50.67) v1(10.39,50.67) v1(10.39,50.67) v2(4.17,52.96) v2(4.17,51.82) v2(4.17,50.67) v2(5.72,52.96) v2(5.72,51.82) v2(5.72,50.67) v2(7.28,52.96) v2(7.28,51.82) v2(7.28,50.67) v2(8.83,52.96) v2(8.83,51.82) v2(8.83,50.67) v2(10.39,52.96) v2(10.39,51.82) v2(10.39,50.67)
+5: length 390.2
  Top Layer w0.254: 14.2,11.94 16.74,9.4 U16.2 ; 14.2,11.94 21.57,11.94 25.89,7.62 ; 14.2,11.94 10.14,16 ; U23.1 22.58,72.86 U21.1 31.98,70.36 34.78,73.15 37.02,73.15 U20.1 42.4,70.61 45.19,73.41 47.73,73.41 U15.2 50.52,71.37 52.81,73.66 58.4,73.66 U17.1 ; U4.3 64.61,15.49 ; U14.3 41.24,15.49
  Top Layer w0.508: 59.54,55.75 64.74,55.75 67.67,52.82 LS1.1 ; R18.2 61.95,55.75
  Top Layer w0.762: R4.1 10.11,16.26 10.11,20.86
  Top Layer w1.016: 40.11,15.49 40.11,23.37 43.92,27.18 v1(43.92,27.43) ; 40.11,15.49 15.47,15.49 10.11,20.86 CC2.1 12.43,24.16 C3.1 12.43,30.23 11.09,31.56 L-2.2 ; 40.11,15.49 84.31,15.49 86.08,13.72 v1(86.08,13.46) ; 10.77,35.43 8.45,37.76 8.45,40.97
  Inner1 w0.254: U17.1 65,67.06 v1(65,64.77)
  Bottom Layer w0.254: 62.95,59.69 62.95,61.45 65,63.5 v1(65,64.77) ; v1(43.92,27.43) 41.63,27.43 41.2,27 TOF1.1
  Bottom Layer w0.381: U8.6 50.34,55.93 51.66,54.61 53.15,54.61
  Bottom Layer w0.762: v1(86.08,13.46) 90.15,13.46 90.15,35.05 R11.2
  Bottom Layer w0.889: R11.2 90.41,44.49 ; 无线串口.7 92.47,44.49 90.42,44.49
  Bottom Layer w1.016: 90.41,44.49 95.52,44.49 97.26,46.23 97.26,49.6 87.18,59.69 59.67,59.69 59.67,55.88 59.54,55.75 ; 59.67,58.93 59.67,57.67 56.21,57.67 53.15,54.61 51.49,52.95 51.49,46.69 50.27,45.47 42.14,45.47 41.63,45.97 41.63,54.1 39.86,55.88 36.05,55.88 EN1.2
BAT: length 50.9
  Top Layer w0.254: C2.1 21.31,42.12 21.31,43.69 21.06,43.94 3.6,43.94 3.34,43.69 3.34,40.97
  Top Layer w0.762: 39.9,33.93 39.36,33.93 39.33,33.9 39.33,32.38 39.22,32.27 v3(39.22,32.26) 36.43,35.05 21.82,35.05 21.31,35.56 21.31,41.2 C2.1
BEEP: length 11.7
  Top Layer w0.254: 1.1 72.62,38.86 73.38,39.62 v1(73.38,45.47)
  Bottom Layer w0.381: v1(73.38,45.47) 73.51,45.59 77.32,45.59
BUJIN_IO_A: length 106.3
  Top Layer w0.254: v1(30.46,32) 30.46,28.96 30.97,28.45 30.97,19.56 v1(30.46,19.05) ; v1(54.08,36.58) 50.27,36.58 47.73,39.12 34.01,39.12 v1(31.73,36.83)
  Inner1 w0.254: v1(30.46,19.05) 25.12,13.72 5.57,13.72 3.53,11.68 3.53,11.37
  Bottom Layer w0.254: 77.32,50.67 67.67,50.67 64.49,47.5 64.49,40.89 60.18,36.58 v1(54.08,36.58) ; v1(30.46,32) 31.73,33.27 v1(31.73,36.83)
BUJIN_IO_B: length 110.1
  Top Layer w0.254: v1(83.8,61.21) 76.94,61.21 76.18,60.45 76.18,55.12 76.68,54.61 78.46,54.61 79.86,53.21
  Inner1 w0.254: v1(83.8,61.21) 76.43,68.58 76.43,73.66 74.91,75.18 6.58,75.18 4.74,73.35 0.99,73.35
CS: length 162.9
  Top Layer w0.254: U17.3 69.06,71.63 72.37,71.63 73.38,70.61 73.38,69.34 75.41,67.31 v1(79.48,67.31) ; v1(52.81,27.43) v1(52.81,19.3)
  Inner1 w0.254: v1(52.81,19.3) 52.05,18.54 52.05,15.24 55.6,11.68 55.6,6.86 58.65,3.81 96.06,3.81 98.78,6.54 98.78,55.63 90.91,63.5 83.29,63.5 v1(79.48,67.31)
  Bottom Layer w0.254: 57,30.35 54.2,30.35 52.81,28.96 v1(52.81,27.43)
DC: length 150.2
  Top Layer w0.254: v1(94.72,57.66) 90.02,62.36 76.56,62.36 72.37,66.55 U17.5 ; 57,27.81 56.24,27.81 54.08,25.65 54.08,19.56 53.83,19.3
  Inner1 w0.254: v1(94.72,57.66) 98.28,54.1 98.28,7.37 97.86,6.95 97.86,6.15 96.28,4.57 58.91,4.57 56.37,7.11 56.37,11.94 52.81,15.49 52.81,18.03 v1(54.08,19.3)
DIR_BUJIN_A: length 108.1
  Top Layer w0.254: v1(52.3,2.79) 50.27,0.76 8.87,0.76 v1(8.11,1.52) ; v1(62.46,30.35) 62.46,18.03 v1(60.94,16.51)
  Inner1 w0.254: 62.71,30.23 72.11,30.23 77.32,35.43
  Bottom Layer w0.254: v1(60.94,16.51) 60.94,11.43 v1(52.3,2.79) ; v1(8.11,1.52) 3.03,1.52 1.76,2.79 1.76,7.6 U18.2
DIR_BUJIN_B: length 101.9
  Inner1 w0.254: v1(79.86,45.59) 81,46.74 81,58.42 76.31,63.12 4.93,63.12 2.02,66.03 2.02,71.35 2.28,71.61 U19.2
EB_RX: length 49
  Top Layer w0.254: 75.41,17.53 75.41,35.05 76.94,36.58 78.46,36.58 79.86,37.97
  Bottom Layer w0.254: 97.01,6.35 93.2,10.16 82.78,10.16 v1(75.67,17.27)
EB_RX_1: length 92.7
  Top Layer w0.254: v1(77.32,53.21) 75.67,54.86 75.67,60.71 76.94,61.98 89.13,61.98 99.04,52.07 99.04,12.95 95.23,9.14 86.84,9.14 H7.4
EB_TX: length 45.9
  Top Layer w0.254: v1(74.65,17.27) 74.65,35.31 77.32,37.97
  Bottom Layer w0.254: 94.21,6.35 90.91,9.65 82.27,9.65 v1(74.65,17.27)
EB_TX_1: length 69.4
  Top Layer w0.254: v1(51.54,27.69) 51.54,18.8 v1(53.57,16.76)
  Inner1 w0.254: v1(53.57,16.76) 55.86,14.48 72.11,14.48 77.96,8.64 79.73,8.64 H7.3
  Bottom Layer w0.254: v1(51.54,27.69) 51.54,45.21 57,50.67
KEY1: length 14.1
  Top Layer w0.254: v1(88.88,17.02) 92,17.02 92.02,17
  Bottom Layer w0.254: 79.86,20.19 80.1,20.19 80.74,19.56 86.84,19.56 88.37,18.03 R8.1 88.87,17.03 v1(88.88,17.02)
KEY2: length 19.6
  Top Layer w0.254: 94.88,17 94.88,15.39 92.95,13.46 90.15,13.46 v1(88.88,14.73)
  Bottom Layer w0.254: v1(88.88,14.73) 88.87,14.74 R7.1 87.35,17.02 80.74,17.02 80.11,17.65 79.86,17.65
KEY3: length 14.3
  Top Layer w0.254: SW_5WAY.4 91.53,24.64 89.64,24.64 v1(88.88,25.4)
  Bottom Layer w0.254: v1(88.88,25.4) 88.87,25.41 R6.1 87.47,27.81 79.86,27.81
KEY4: length 17.7
  Top Layer w0.254: v1(88.88,22.61) 94.21,22.61 94.88,23.27 SW_5WAY.6
  Bottom Layer w0.254: v1(88.88,22.61) 88.88,23.36 R5.1 87.6,24.64 80.74,24.64 80.1,25.27 79.86,25.27
KEY5: length 18.8
  Top Layer w0.254: 93.42,17 93.42,17.81 92.18,19.05 88.37,19.05 87.35,20.07 v1(87.35,20.57)
  Bottom Layer w0.254: 79.86,22.73 80.37,22.23 86.72,22.23 87.35,21.59 v1(87.35,20.57) R17.1
KEY6: length 32.2
  Top Layer w0.254: SW3.2 83.34,43.76 80.26,46.83 76.8,46.83 73.59,50.04 70.13,50.04 69.38,50.79 R18.1
  Top Layer w0.381: R18.1 59.66,50.79 59.54,50.67
KEY11: length 12.7
  Top Layer w0.381: SW5.4 87.86,33.78 v1(86.84,33.78) 86.72,33.91 81.38,33.91 79.86,35.43
  Bottom Layer w0.381: R11.1 87.6,33.78 v1(86.84,33.78)
KEY22: length 12.4
  Top Layer w0.381: 79.86,32.89 81.13,32.89 82.02,32 v1(86.84,32) 87.1,32 SW5.5
  Bottom Layer w0.381: v1(86.84,32) 88.36,32 R10.1
KEY33: length 16
  Top Layer w0.254: 77.32,32.89 78.59,31.62 80.37,31.62 82.53,29.46 v2(86.84,29.46) 88.62,27.69 SW5.6
  Bottom Layer w0.381: R9.1 88.87,29.46 88.86,29.46 v2(86.84,29.46)
L_DIR: length 28.8
  Top Layer w0.254: v1(38.59,13.46) 38.59,10.67 38.74,10.51 U14.1
  Bottom Layer w0.254: 59.41,22.61 58.14,21.34 51.03,21.34 45.44,15.75 39.35,15.75 38.59,14.99 v1(38.59,13.46)
L_IN+: length 26.9
  Top Layer w0.254: 59.54,43.05 61.7,43.05 61.7,49.02 61.19,49.53 58.91,49.53 58.14,50.29 58.14,56.39 56.62,57.91 50.68,57.91 U6.1
L_IN-: length 20.5
  Top Layer w0.254: U6.2 49,58.14 49,56.39 53.57,56.39 54.33,55.63 54.33,51.56 56.36,49.53 57.63,49.53 58.27,48.9 58.27,46.86 59.54,45.59
L_STEP: length 27.2
  Top Layer w0.254: U14.2 40.11,10.31 v1(40.11,13.97)
  Bottom Layer w0.254: v1(40.11,13.97) 55.6,13.97 58.4,16.76 58.4,19.05 59.54,20.19
MOSI: length 40.5
  Top Layer w0.254: v1(52.3,55.63) 52.3,52.83 57,48.13
  Bottom Layer w0.254: U17.6 74.91,68.33 72.11,65.53 59.41,65.53 55.35,61.47 55.35,59.69 52.3,56.64 v1(52.3,55.63)
NSLEEP: length 23.8
  Top Layer w0.254: EN1.1 32.24,47.88 32.24,46.98 RL3.1 ; 47.73,53.85 47.77,53.85 47.85,53.92 U6.3
  Inner1 w0.254: EN1.1 37.32,52.96 46.97,52.96 v1(47.73,53.72) 47.73,53.85
PIN0.4: length 59.2
  Top Layer w0.254: 77.32,48.13 74.53,50.93 74.53,61.85 70.59,65.79 38.08,65.79 34.56,69.3 U20.3
PIN3.3: length 37.3
  Bottom Layer w0.254: 57,22.73 50.39,22.73 44.43,16.76 34.52,16.76 29.69,11.94 29.69,7.66 29.73,7.62 U22.3
PIN5.0: length 139.1
  Top Layer w0.254: v1(47.48,2.79) 2.01,2.79 1.25,3.56 1.25,62.48 6.58,67.82 10.86,67.82 U23.3
  Bottom Layer w0.254: v1(47.47,2.79) 50.78,2.79 59.54,11.56 59.54,17.65
PIN5.2: length 52.7
  Top Layer w0.254: 59.54,53.21 59.54,53.98 58.53,54.99 58.53,57.02 v1(56.62,58.93) ; v1(55.35,62.48) 54.84,62.99 22.08,62.99 20.08,64.98 U21.3
  Inner1 w0.254: v1(56.62,58.93) 55.35,60.2 v1(55.35,62.48)
PWM_BUJIN_A: length 95.8
  Inner1 w0.254: 77.32,40.51 68.3,31.5 49,31.5 47.73,32.77 47.73,36.07 45.19,38.61 38.59,38.61 v1(38.08,38.1)
  Bottom Layer w0.254: v1(38.08,38.1) 12.44,12.47 9.63,12.47 3.53,6.37
PWM_BUJIN_B: length 101.9
  Inner1 w0.254: v1(82.27,58.42) 76.68,64.01 7.85,64.01 3.02,68.83 U19.3
  Bottom Layer w0.254: 79.86,43.05 84.3,47.5 84.3,56.39 v1(82.27,58.42)
R_DIR: length 30.5
  Top Layer w0.254: v1(71.1,26) 71.1,19.05 ; v1(61.95,11.94) 62.11,11.78 U4.1
  Bottom Layer w0.254: v1(71.1,18.99) 64.05,11.94 v1(61.95,11.94) ; 71.1,26.16 71.1,28.7 72.37,29.97 76.94,29.97 77.32,30.35
R_IN+: length 41.2
  Top Layer w0.254: U6.5 45.19,58.08 45.19,53.24 56.77,41.66 60.94,41.66 61.45,40.89 61.45,28.45 60.94,27.94 59.54,27.94 59.54,27.81
R_IN-: length 38.8
  Top Layer w0.254: 59.54,30.35 60.81,31.62 60.81,38.73 60.43,39.12 56.68,39.12 44.43,51.82 44.18,52.06 44.06,58.94 U6.6
R_STEP: length 16.8
  Top Layer w0.254: U4.2 63.36,13.33 v1(63.22,13.46)
  Bottom Layer w0.254: v1(63.22,13.46) 63.22,19.05 60.94,21.34 58.9,21.34 57.76,20.19 57,20.19
RST: length 37.4
  Inner1 w0.254: v1(83.29,55.37) 83.29,58.93 74.65,67.56 72.11,67.56 U17.4
  Bottom Layer w0.254: v1(83.29,55.37) 83.29,47.24 80.5,44.45 78.72,44.45 77.32,43.05
SCK_SPI: length 65.3
  Top Layer w0.254: 56.11,65.02 61.95,65.02 62.21,64.77 62.21,61.98 v1(65.76,58.42)
  Bottom Layer w0.254: U17.7 77.45,70.07 73.86,73.66 61.95,73.66 56.11,67.82 v1(56.11,64.99) ; v1(65.76,58.42) 65.76,50.04 63.99,48.26 63.99,42.42 59.54,37.97
SCL: length 30.9
  Inner1 w0.254: 57,32.89 55.47,34.42 52.43,34.42 49.76,37.08 v1(49.76,55.37)
  Bottom Layer w0.254: v1(49.76,55.37) 47.84,57.29 U8.4
SDA: length 28.8
  Inner1 w0.254: v1(46.71,55.63) 47.98,56.9 55.67,56.9 55.67,41.85 57,40.51
  Bottom Layer w0.254: 46.71,58.04 v1(46.71,55.63)
SERVO1: length 47.3
  Top Layer w0.254: 79.86,48.13 78.46,49.53 76.94,49.53 74.91,51.56 74.91,62.01 70.62,66.29 52.34,66.29 U15.3
SERVO2: length 99.2
  Top Layer w0.254: 79.86,40.51 78.72,39.37 75.41,39.37 74.4,38.35 74.4,37.85 73.64,37.08 73.64,17.53
  Bottom Layer w0.254: 79.86,40.51 80.06,40.71 ; U16.3 19.24,5.37 22.84,1.78 69.83,1.78 73.64,5.59 v1(73.64,17.27)
TOF_INT: length 49.3
  Inner1 w0.254: v1(35.03,30.48) 35.28,30.73 37.27,30.73 39.04,28.96 61.2,28.96 61.7,29.46 75.67,29.46 77.32,27.81
  Bottom Layer w0.254: v1(35.03,30.48) 34.95,30.48 TOF1.6
TOF_SCL: length 52.8
  Bottom Layer w0.254: TOF1.3 38.58,25.21 38.58,18.29 39.09,17.78 43.92,17.78 50.01,23.88 62.97,23.88 63.48,23.37 63.48,20.57 63.98,20.07 74.91,20.07 77.32,17.65
TOF_SDA: length 48.9
  Bottom Layer w0.254: 77.32,20.19 75.04,22.48 75.04,24.64 74.78,24.89 61.75,24.89 59.97,26.67 52.01,26.67 51.51,26.16 51.03,26.16 48.24,28.96 37.57,28.96 37.32,28.7 37.32,25.65 37.45,25.52 TOF1.4
TOF_XS: length 47.3
  Inner1 w0.254: 77.32,22.73 73.13,26.92 61.45,26.92 60.94,26.42 47.98,26.42 46.21,28.19 36.3,28.19 v1(36.05,28.45)
  Bottom Layer w0.254: TOF1.5 36.04,25.33 v1(36.04,28.45)
UART_CMD: length 22.3
  Top Layer w0.254: 77.32,55.75 77.32,57.02 77.95,57.66 85.83,57.66 无线串口.8
UART_RST: length 13.3
  Top Layer w0.254: 无线串口.4 89.39,50.8 88.88,51.31 85.07,51.31 81,55.37 79.86,55.75
UART_RX: length 53.7
  Bottom Layer w0.254: 57,37.97 54.21,37.97 53.06,36.83 53.06,34.63 55.95,31.75 80.49,31.75 83.8,35.05 83.8,40.89 无线串口.3
UART_TX: length 34.2
  Bottom Layer w0.254: 无线串口.1 83.03,42.67 83.03,38.75 80.86,36.58 71.1,36.58 69.95,35.43 59.54,35.43
$1N3: length 49.3
  Top Layer w0.254: v1(70.08,34.29) 73.69,37.9 73.69,38.91 76.49,41.71 80.4,41.71 81.51,40.59 81.51,37.8 82.63,36.68 96.04,36.68 SW4.2
  Bottom Layer w0.254: 57,35.43 58.14,34.29 v1(70.08,34.29)
$1N24: length 11.9
  Top Layer w1.016: 5.05,40.97 5.05,36.06 4.3,35.31 ; L-2.1 3.91,34.48 3.91,28.77 D3.2
$1N55: length 9.6
  Top Layer w0.381: Q1.3 v2(65.32,41.91)
  Bottom Layer w0.508: LS1.2 68.05,47.18 65.32,44.45 v2(65.32,41.91)
$1N83: length 2.3
  Top Layer w0.762: L2.A R4.2
$1N88: length 4.4
  Top Layer w0.381: 10.2 70.32,38.87 70.32,38.87 ; 70.32,38.87 Q1.1 ; 70.32,38.87 1.2
$1N135: length 2.5
  Top Layer w0.254: RL3.2 LED3.1

## Copper pours and planes (outline as drawn; the poured copper is in the pictures)
GND on Top Layer: 7.05,27.7 9.04,27.7 9.04,26.69 7.05,26.69
GND on Top Layer: -2.06,78.99 102.59,78.99 102.59,-1.52 -2.06,-1.52
GND on Top Layer: 9.05,29.43 10.06,29.43 10.06,27.97 9.05,27.97
GND on Top Layer: 9.04,29.7 10.06,29.7 10.06,27.7 9.04,27.7
GND on Top Layer: 2.13,20.45 9.75,20.45 9.75,26.42 2.13,26.42
GND on Bottom Layer: -2.06,78.99 102.34,78.99 102.34,-1.27 -2.06,-1.27
GND on Inner1: -1.8,78.53 102.08,78.53 102.08,-1.27 -1.8,-1.27
GND on Inner2: -1.8,78.74 102.08,78.74 102.08,-1.27 -1.8,-1.27
+5 on Top Layer: 67.38,53.1 68.4,53.1 68.4,52.1 67.38,52.1
+5 on Top Layer: 9.12,37.01 11.24,37.01 11.24,35.03 9.12,35.03
+5 on Top Layer: 10.07,32.8 12.1,32.8 12.1,31.78 10.07,31.78
BAT on Top Layer: 4.29,37.59 2.77,37.59 2.77,44.2 19.91,44.2 19.91,42.67 4.93,42.67 4.29,42.42
BAT on Top Layer: 38.95,33.84 40.09,33.84 40.09,32.82 38.95,32.82
BAT on Top Layer: 12.74,47.75 12.68,57.91 7.85,57.91 7.79,62.99 14.77,62.99 14.71,52.58 21.06,52.58 21.12,47.75
BAT on Top Layer: 15.22,52.58 22.84,52.58 23.09,42.29 23.09,34.04 18.52,34.04 18.52,44.2 15.22,44.2
BAT on Bottom Layer: 8.1,62.74 8.23,55.12 11.53,55.12 11.53,49.02 22.2,49.02 22.2,52.83 14.45,52.83 14.45,62.74
NETCN1_2 on Top Layer: 30.71,57.02 23.95,57.02 21.55,53.34 15.34,53.34 15.34,58.55 20.93,58.55 24.36,61.98 30.71,61.98
S1_2 on Bottom Layer: 30.46,57.02 23.7,57.02 21.29,53.34 15.09,53.34 15.09,58.55 20.68,58.55 24.11,61.98 30.46,61.98
S1_2 on Bottom Layer: 15.09,61.95 30.71,61.95 30.71,53.34 15.09,53.34
$1N24 on Top Layer: 2.89,32.8 4.93,32.8 4.93,31.78 2.89,31.78
$1N24 on Top Layer: 2.89,30.72 4.84,30.72 4.84,29.7 2.89,29.7
$1N50 on Bottom Layer: 30.71,57.02 23.95,57.02 21.55,53.34 15.34,53.34 15.34,58.55 20.93,58.55 24.36,61.98 30.71,61.98

Small or netless copper shapes (teardrops, artwork), in the pictures only: 40 on Top Layer, 19 on Bottom Layer, 1 on Inner1

## Text on the board
Bottom Silkscreen Layer: 100 | 10k
Top Layer: 林冠铮、林兆先 | 武汉理工大学 | 2024.07.24
Top Solder Mask Layer: 林冠铮、林兆先 | 武汉理工大学 | 2024.07.24
Top Silkscreen Layer: bujin_B | bujin_A | GND | 5V | pin5.2 | pin3.3 | pin0.4 | TX | RX | 10k | RST | + | 3 | 1 | 5 | 2 | 4 | 1k | G V S | - | 8765 | BMQ_L | BMQ_R | 霍尔 | Servo1 | Servo2 | UART1 | UART2 | 开
